# EAGLE design buck (EAGLE 9.1.3)
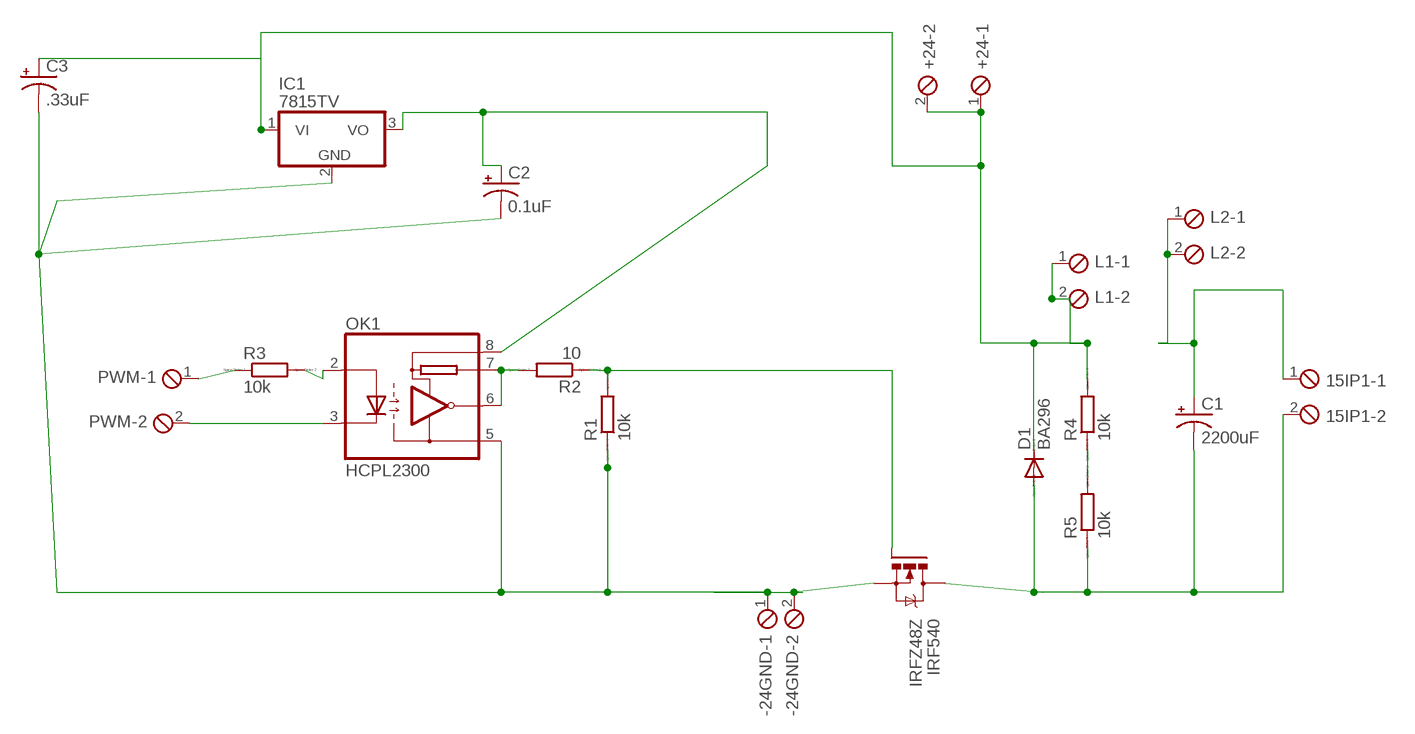
[diagram p0: schematic, sheet 1]

## Parts
15IP1  MPT2  [2POL254]
+24  MPT2  [2POL254]
-24GND  MPT2  [2POL254]
C1  2200uF  1000UF-RADIAL-5MM-25V-20%  [CPOL-RADIAL-5MM-10MM]
C2  0.1uF  1000UF-RADIAL-5MM-25V-20%  [CPOL-RADIAL-5MM-10MM]
C3  .33uF  1000UF-RADIAL-5MM-25V-20%  [CPOL-RADIAL-5MM-10MM]
D1  BA296  [P2-15]
IC1  7815TV  [TO220V]
IRF540  IRFZ48Z  [TO220BH]
L1  MPT2  [2POL254]
L2  MPT2  [2POL254]
OK1  HCPL2300  [DIL08]
PWM  MPT2  [2POL254]
R1  10k  R0204/7  [0204/7]
R2  10  R0204/7  [0204/7]
R3  10k  R0204/7  [0204/7]
R4  10k  R0204/7  [0204/7]
R5  10k  R0204/7  [0204/7]

## Nets
GND: -24GND.1 -24GND.2 C2.- C3.- IC1.2(GND) IRF540.S OK1.5(GND) R1.1
N$1: PWM.1 R3.1
N$2: R4.1 R5.2
N$3: OK1.3(C) PWM.2
N$4: OK1.2(A) R3.2
N$5: +24.1 +24.2 C3.+ D1.C IC1.1(VI) L1.1 L1.2 R4.2
N$6: 15IP1.2 C1.- D1.A IRF540.D R5.1
N$7: IRF540.G R1.2 R2.1
N$9: 15IP1.1 C1.+ L2.1 L2.2
N$10: C2.+ IC1.3(VO) OK1.8(VCC)
N$11: OK1.6(VO) OK1.7(RL) R2.2

## Library data of the parts
15IP1 +24 -24GND L1 L2 PWM = con-phoenix-254:MPT2: PHOENIX CONNECTOR; OC_FARNELL: unknown; OC_NEWARK: unknown
C1-C3 = SparkFun-Capacitors:1000UF: 1,000µF/1mF ceramic capacitors A capacitor is a passive two-terminal electrical component used to store electrical energy temporarily in an electric field. CAP-08070; PROD_ID: CAP-09538; VALUE: 1mF
D1 = diode:BA296: DIODE
IC1 = linear:78*: Positive VOLTAGE REGULATOR Source: http://cache.national.com/ds/LM/LM78L05.pdf http://www.fairchildsemi.com/ds/LM/LM7805.pdf
IRF540 = transistor-power:IRFZ48: N Channel HEXFET® Power MOSFET Logic Level Source: http://www.irf.com/product-info/datasheets/data/irfz48z.pdf
OK1 = optocoupler:HCPL2300: HEWLETT PACKARD OPTO COUPLER; MF: AGILENT TECHNOLOGIES; MPN: HCPL-2300-000E; OC_FARNELL: 9129855; OC_NEWARK: 88H7805
R1-R5 = eagle-ltspice:R: RESISTOR, European symbol; SPICEMODEL: NONE; SPICEPREFIX: R

## Board
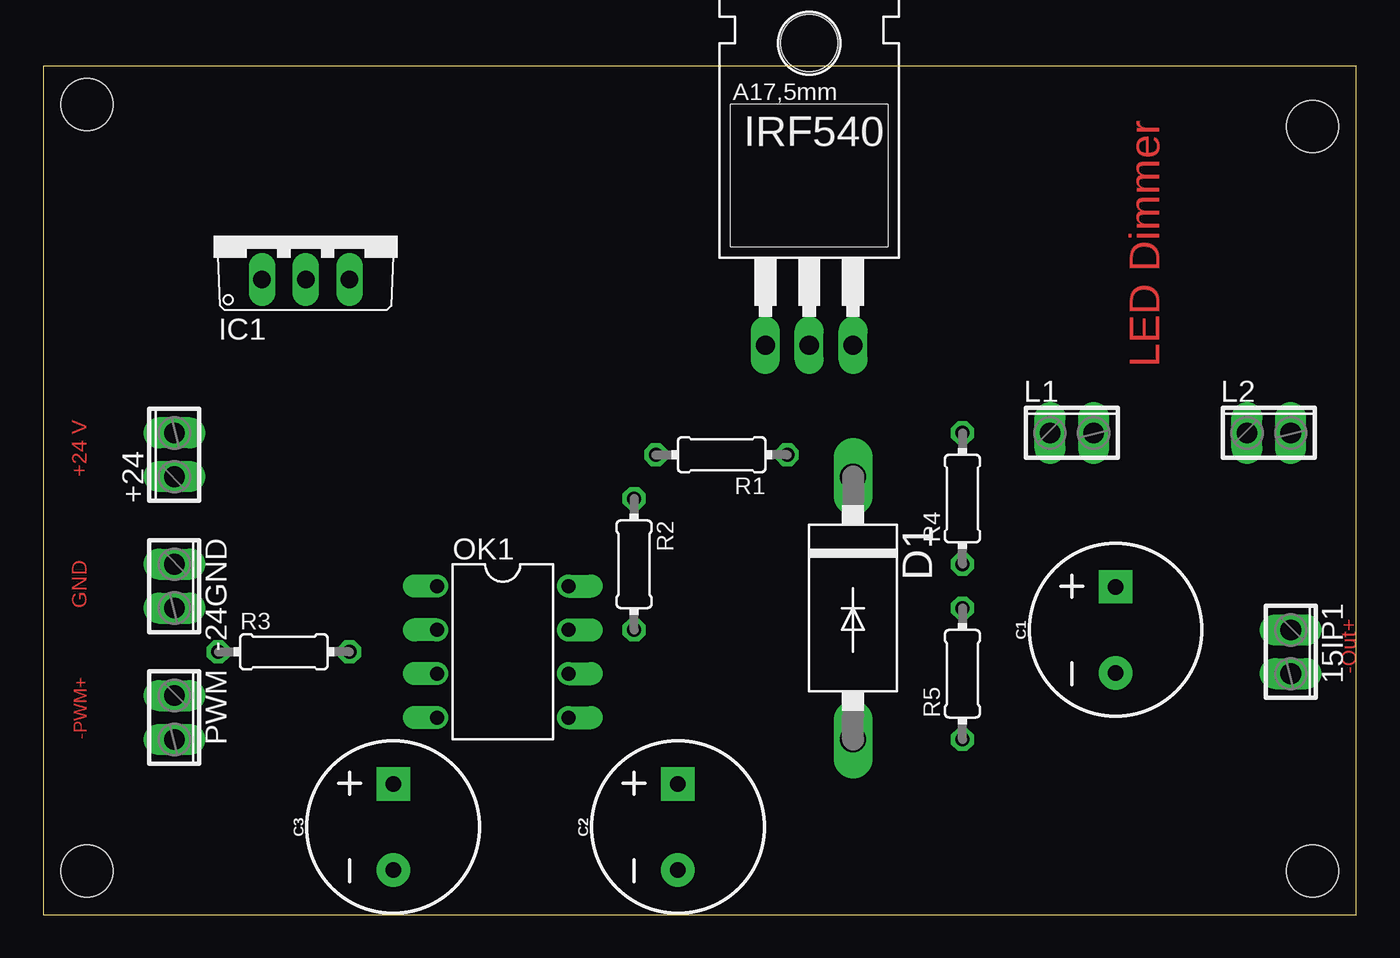
[diagram p1: board, top side]
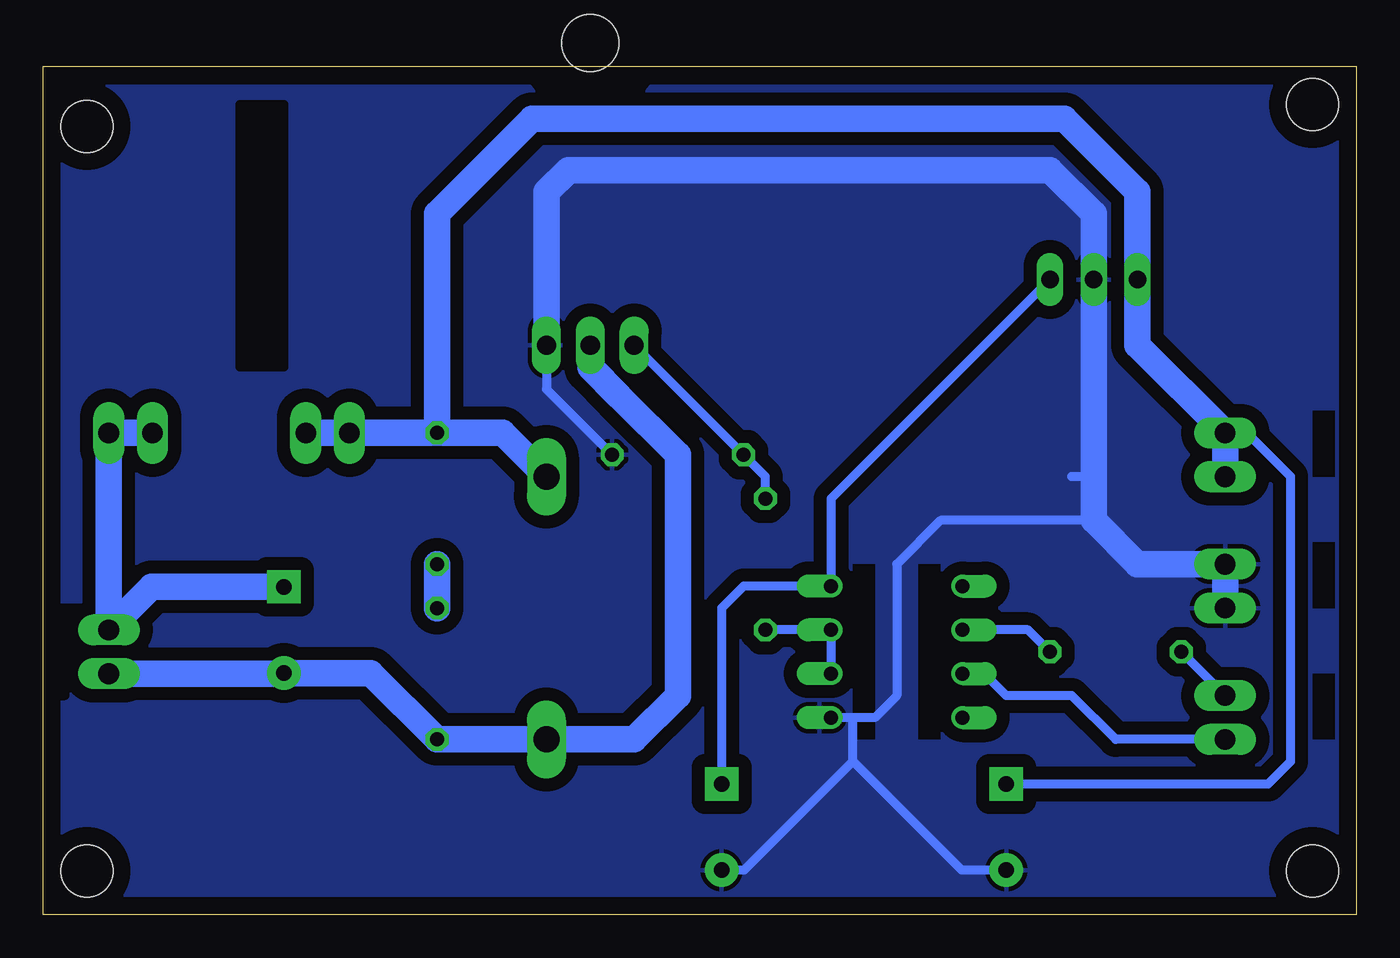
[diagram p2: board, bottom side, seen from below]

Size 76.18 x 49.2 mm. Coordinates in mm from the lower left corner, seen from the top.
Outline: 0,0 76.18,0 76.18,49.2 0,49.2 0,0
Copper layers (1*16): Top 0.035mm / dielectric 1.5mm / Bottom 0.035mm
Design rules "default *": minimum track width 20mil, minimum drill 1mm, track to track 30mil, track to pad 30mil, pad to pad 20mil, via to via 20mil, smd to smd 6mil, copper to edge 40mil, drill to drill 6mil, minimum pad ring 10mil, minimum via ring 8mil, stop-mask expansion 4mil, vias tented up to drill 0mil, thermal gap 10mil
Holes 3 mm at 2.54,46.99 2.54,2.54 73.66,2.54 73.66,45.72
bRestrict: area 73.7,12.7 to 76.2,17.8; area 62.2,31.8 to 64.8,47; area 1.3,25.4 to 2.5,29.2; area 1.3,17.8 to 2.5,21.6; area 1.3,10.2 to 2.5,14; area 24.1,10.2 to 25.4,20.3; area 27.9,10.2 to 29.2,20.3

### Footprints (pad centres in the part's own frame; a part is rotated, then mirrored left to right if it is on the bottom)
2POL254 = drill 1.2 long: 1 -1.27,0; 2 1.27,0
CPOL-RADIAL-5MM-10MM = drill 0.9 pad 1.93 square: + 2.5,0 | drill 0.9 pad 1.93: - -2.5,0
P2-15 = drill 1.499 long: A 7.62,0; C -7.62,0
TO220V = drill 1.016 long: 1 -2.54,-2.54; 2 0,-2.54; 3 2.54,-2.54
TO220BH = drill 1.118 long: D 0,-6.35; G -2.54,-6.35; S 2.54,-6.35 | hole 3.302: 0,11.176
DIL08 = drill 0.813 offset: 1 -3.81,-3.81; 2 -1.27,-3.81; 3 1.27,-3.81; 4 3.81,-3.81; 5 3.81,3.81; 6 1.27,3.81; 7 -1.27,3.81; 8 -3.81,3.81
0204/7 = drill 0.813 octagon: 1 -3.81,0; 2 3.81,0

### Placement (x,y rotation side)
15IP1  72.39,15.24 270 top
+24  7.62,26.67 90 top
-24GND  7.62,19.05 270 top
C1  62.23,16.51 90 top
C2  36.83,5.08 90 top
C3  20.32,5.08 90 top
D1  46.99,17.78 270 top
IC1  15.24,39.37 0 top
IRF540  44.45,39.37 0 top
L1  59.69,27.94 0 top
L2  71.12,27.94 0 top
OK1  26.67,15.24 270 top
PWM  7.62,11.43 270 top
R1  39.37,26.67 180 top
R2  34.29,20.32 270 top
R3  13.97,15.24 0 top
R4  53.34,24.13 90 top
R5  53.34,13.97 90 top

### Tracks (layer width: path | path; a pad name or v marks a point on that pad's centre or on a via)
GND
  Bottom 0.508: IRF540.S 46.99,30.48 R1.1 | 15.24,22.86 24.13,22.86 26.67,20.32 26.67,12.7 27.94,11.43 29.21,11.43 | 29.21,11.43 OK1.5 | 15.24,25.4 16.51,25.4 | C3.- 22.9,2.58 29.21,8.89 | 29.21,8.89 29.21,11.43 | 29.21,8.89 35.52,2.58 C2.-
  Bottom 1.524: -24GND.2 -24GND.1 12.7,20.32 15.24,22.86 15.24,25.4 IC1.2 15.24,40.64 17.78,43.18 45.72,43.18 46.99,41.91 IRF540.S
  pour Bottom: 0,48.26 76.2,48.26 76.2,0 0,0
N$1
  Bottom 0.508: PWM.1 R3.1
N$2
  Bottom 1.524: R4.1 R5.2
N$3
  Bottom 0.508: PWM.2 13.97,10.16 16.51,12.7 20.32,12.7 21.59,13.97 22.61,13.97 OK1.3
N$4
  Bottom 0.508: R3.2 19.05,16.51 21.59,16.51 22.61,16.51 OK1.2
N$5
  Bottom 0.508: C3.+ 5.12,7.58 3.81,8.89 3.81,25.4 6.35,27.94 +24.2
  Bottom 1.524: +24.1 +24.2 12.7,33.02 IC1.1 12.7,41.91 16.94,46.15 47.83,46.15 53.34,40.64 R4.2 | R4.2 49.53,27.94 D1.C | L1.2 L1.1 R4.2
N$6
  Bottom 1.524: 15IP1.2 62.27,13.97 C1.- 57.19,14.01 R5.1 D1.A 41.91,10.16 39.37,12.7 39.37,26.67 42.77,30.07 42.78,30.07 44.45,31.74 IRF540.D
N$7
  Bottom 0.508: R2.1 34.29,25.4 R1.2 IRF540.G
N$9
  Bottom 1.524: L2.1 L2.2 15IP1.1 69.89,19.01 C1.+
N$10
  Bottom 0.508: IC1.3 30.48,24.13 OK1.8 35.56,19.05 36.83,17.78 C2.+
N$11
  Bottom 0.508: OK1.6 OK1.7 R2.2

### Text on the board
Top: LED Dimmer | +24 V | GND | -Out+ | -PWM+